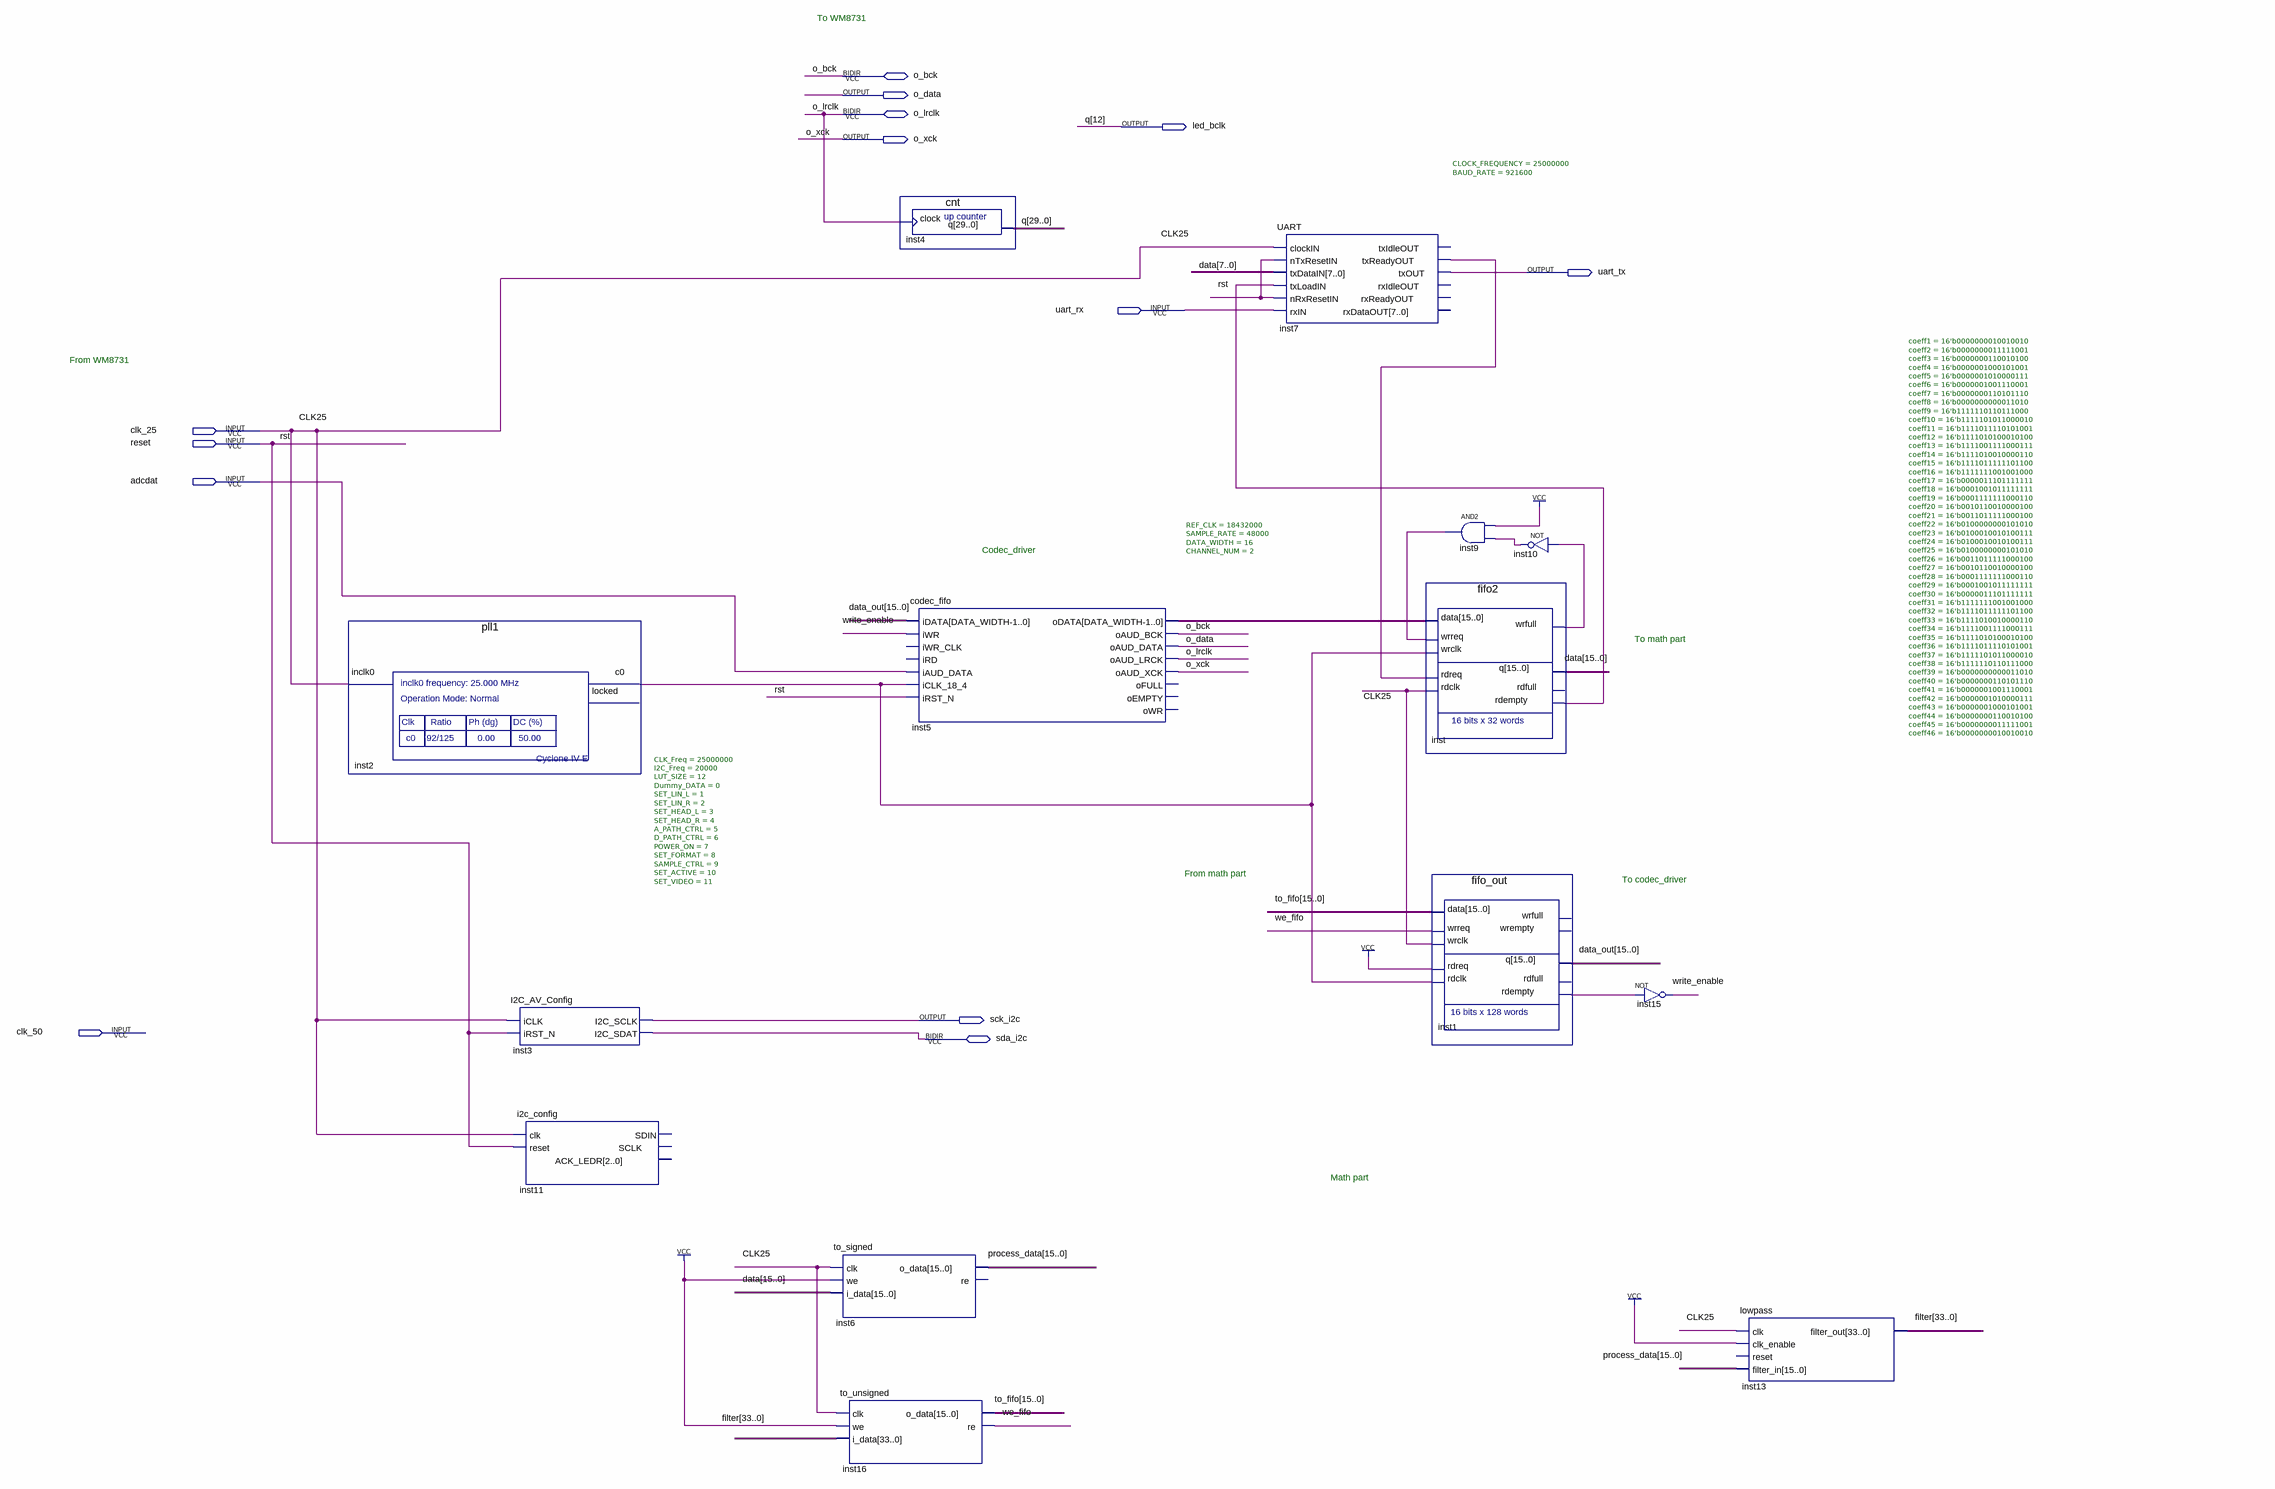
[diagram p0: schematic sheet]
// Quartus schematic dsp.bdf as structural Verilog: 14 symbols, 13 pins
module dsp (
  input  uart_rx,
  input  clk_25,
  input  reset,
  input  adcdat,
  input  clk_50,
  inout  o_bck,
  inout  o_lrclk,
  inout  sda_i2c,
  output o_data,
  output led_bclk,
  output o_xck,
  output uart_tx,
  output sck_i2c
);

  wire inst1_rdempty, inst2_c0, inst7_txreadyout, inst9_out, inst10_out, inst_rdempty, inst_wrfull, we_fifo,
       write_enable;
  wire [15:0] data, data_out, inst5_odata, process_data, to_fifo;
  wire [29:0] q;
  wire [33:0] filter;

  pll1 inst2 (.inclk0(clk_25), .c0(inst2_c0));  // open: locked
  I2C_AV_Config #(.CLK_Freq(25000000), .I2C_Freq(20000), .LUT_SIZE(12), .Dummy_DATA(0), .SET_LIN_L(1), .SET_LIN_R(2), .SET_HEAD_L(3), .SET_HEAD_R(4), .A_PATH_CTRL(5), .D_PATH_CTRL(6), .POWER_ON(7), .SET_FORMAT(8), .SAMPLE_CTRL(9), .SET_ACTIVE(10), .SET_VIDEO(11)) inst3 (
    .iCLK(clk_25), .iRST_N(reset), .I2C_SCLK(sck_i2c), .I2C_SDAT(sda_i2c));
  i2c_config inst11 (.clk(clk_25), .reset(reset));  // open: SCLK, ACK_LEDR, SDIN
  to_signed inst6 (.clk(clk_25), .we(1'b1), .i_data(data), .o_data(process_data));  // open: re
  to_unsigned inst16 (.clk(clk_25), .we(1'b1), .i_data(filter), .o_data(to_fifo), .re(we_fifo));
  cnt inst4 (.clock(o_lrclk), .q({q[29:13], led_bclk, q[11:0]}));
  codec_fifo #(.REF_CLK(18432000), .SAMPLE_RATE(48000), .DATA_WIDTH(16), .CHANNEL_NUM(2)) inst5 (
    .iDATA(data_out), .iWR(write_enable), .iAUD_DATA(adcdat), .iCLK_18_4(inst2_c0), .iRST_N(reset),
    .oDATA(inst5_odata), .oAUD_BCK(o_bck), .oAUD_DATA(o_data), .oAUD_LRCK(o_lrclk), .oAUD_XCK(o_xck));  // open: iWR_CLK, iRD, oFULL, oEMPTY, oWR
  UART #(.CLOCK_FREQUENCY(25000000), .BAUD_RATE(921600)) inst7 (
    .clockIN(clk_25), .nTxResetIN(reset), .txDataIN(data[7:0]), .txLoadIN(inst_rdempty), .nRxResetIN(reset),
    .rxIN(uart_rx), .txReadyOUT(inst7_txreadyout), .txOUT(uart_tx));  // open: txIdleOUT, rxIdleOUT, rxReadyOUT, rxDataOUT
  fifo2 inst (
    .data(inst5_odata), .wrreq(inst9_out), .wrclk(inst2_c0), .rdreq(inst7_txreadyout), .rdclk(clk_25),
    .wrfull(inst_wrfull), .q(data), .rdempty(inst_rdempty));  // open: rdfull
  and inst9 (inst9_out, 1'b1, inst10_out);
  fifo_out inst1 (
    .data(to_fifo), .wrreq(we_fifo), .wrclk(clk_25), .rdreq(1'b1), .rdclk(inst2_c0), .q(data_out),
    .rdempty(inst1_rdempty));  // open: wrfull, wrempty, rdfull
  not inst10 (inst10_out, inst_wrfull);
  not inst15 (write_enable, inst1_rdempty);
  lowpass #(.coeff1(16'b0000000010010010), .coeff2(16'b0000000011111001), .coeff3(16'b0000000110010100), .coeff4(16'b0000001000101001), .coeff5(16'b0000001010000111), .coeff6(16'b0000001001110001), .coeff7(16'b0000000110101110), .coeff8(16'b0000000000011010), .coeff9(16'b1111110110111000), .coeff10(16'b1111101011000010), .coeff11(16'b1111011110101001), .coeff12(16'b1111010100010100), .coeff13(16'b1111001111000111), .coeff14(16'b1111010010000110), .coeff15(16'b1111011111101100), .coeff16(16'b1111111001001000), .coeff17(16'b0000011101111111), .coeff18(16'b0001001011111111), .coeff19(16'b0001111111000110), .coeff20(16'b0010110010000100), .coeff21(16'b0011011111000100), .coeff22(16'b0100000000101010), .coeff23(16'b0100010010100111), .coeff24(16'b0100010010100111), .coeff25(16'b0100000000101010), .coeff26(16'b0011011111000100), .coeff27(16'b0010110010000100), .coeff28(16'b0001111111000110), .coeff29(16'b0001001011111111), .coeff30(16'b0000011101111111), .coeff31(16'b1111111001001000), .coeff32(16'b1111011111101100), .coeff33(16'b1111010010000110), .coeff34(16'b1111001111000111), .coeff35(16'b1111010100010100), .coeff36(16'b1111011110101001), .coeff37(16'b1111101011000010), .coeff38(16'b1111110110111000), .coeff39(16'b0000000000011010), .coeff40(16'b0000000110101110), .coeff41(16'b0000001001110001), .coeff42(16'b0000001010000111), .coeff43(16'b0000001000101001), .coeff44(16'b0000000110010100), .coeff45(16'b0000000011111001), .coeff46(16'b0000000010010010)) inst13 (
    .clk(clk_25), .clk_enable(1'b1), .filter_in(process_data), .filter_out(filter));  // open: reset

  // Other names for the same wires on the sheet: CLK25 = clk_25; q[12] = led_bclk; rst = reset

  // Notes on the sheet:
  //   To WM8731
  //   From WM8731
  //   Codec_driver
  //   To math part
  //   From math part
  //   To codec_driver
  //   Math part
endmodule
